# EAGLE design alarm clock_003 (EAGLE 5.11)
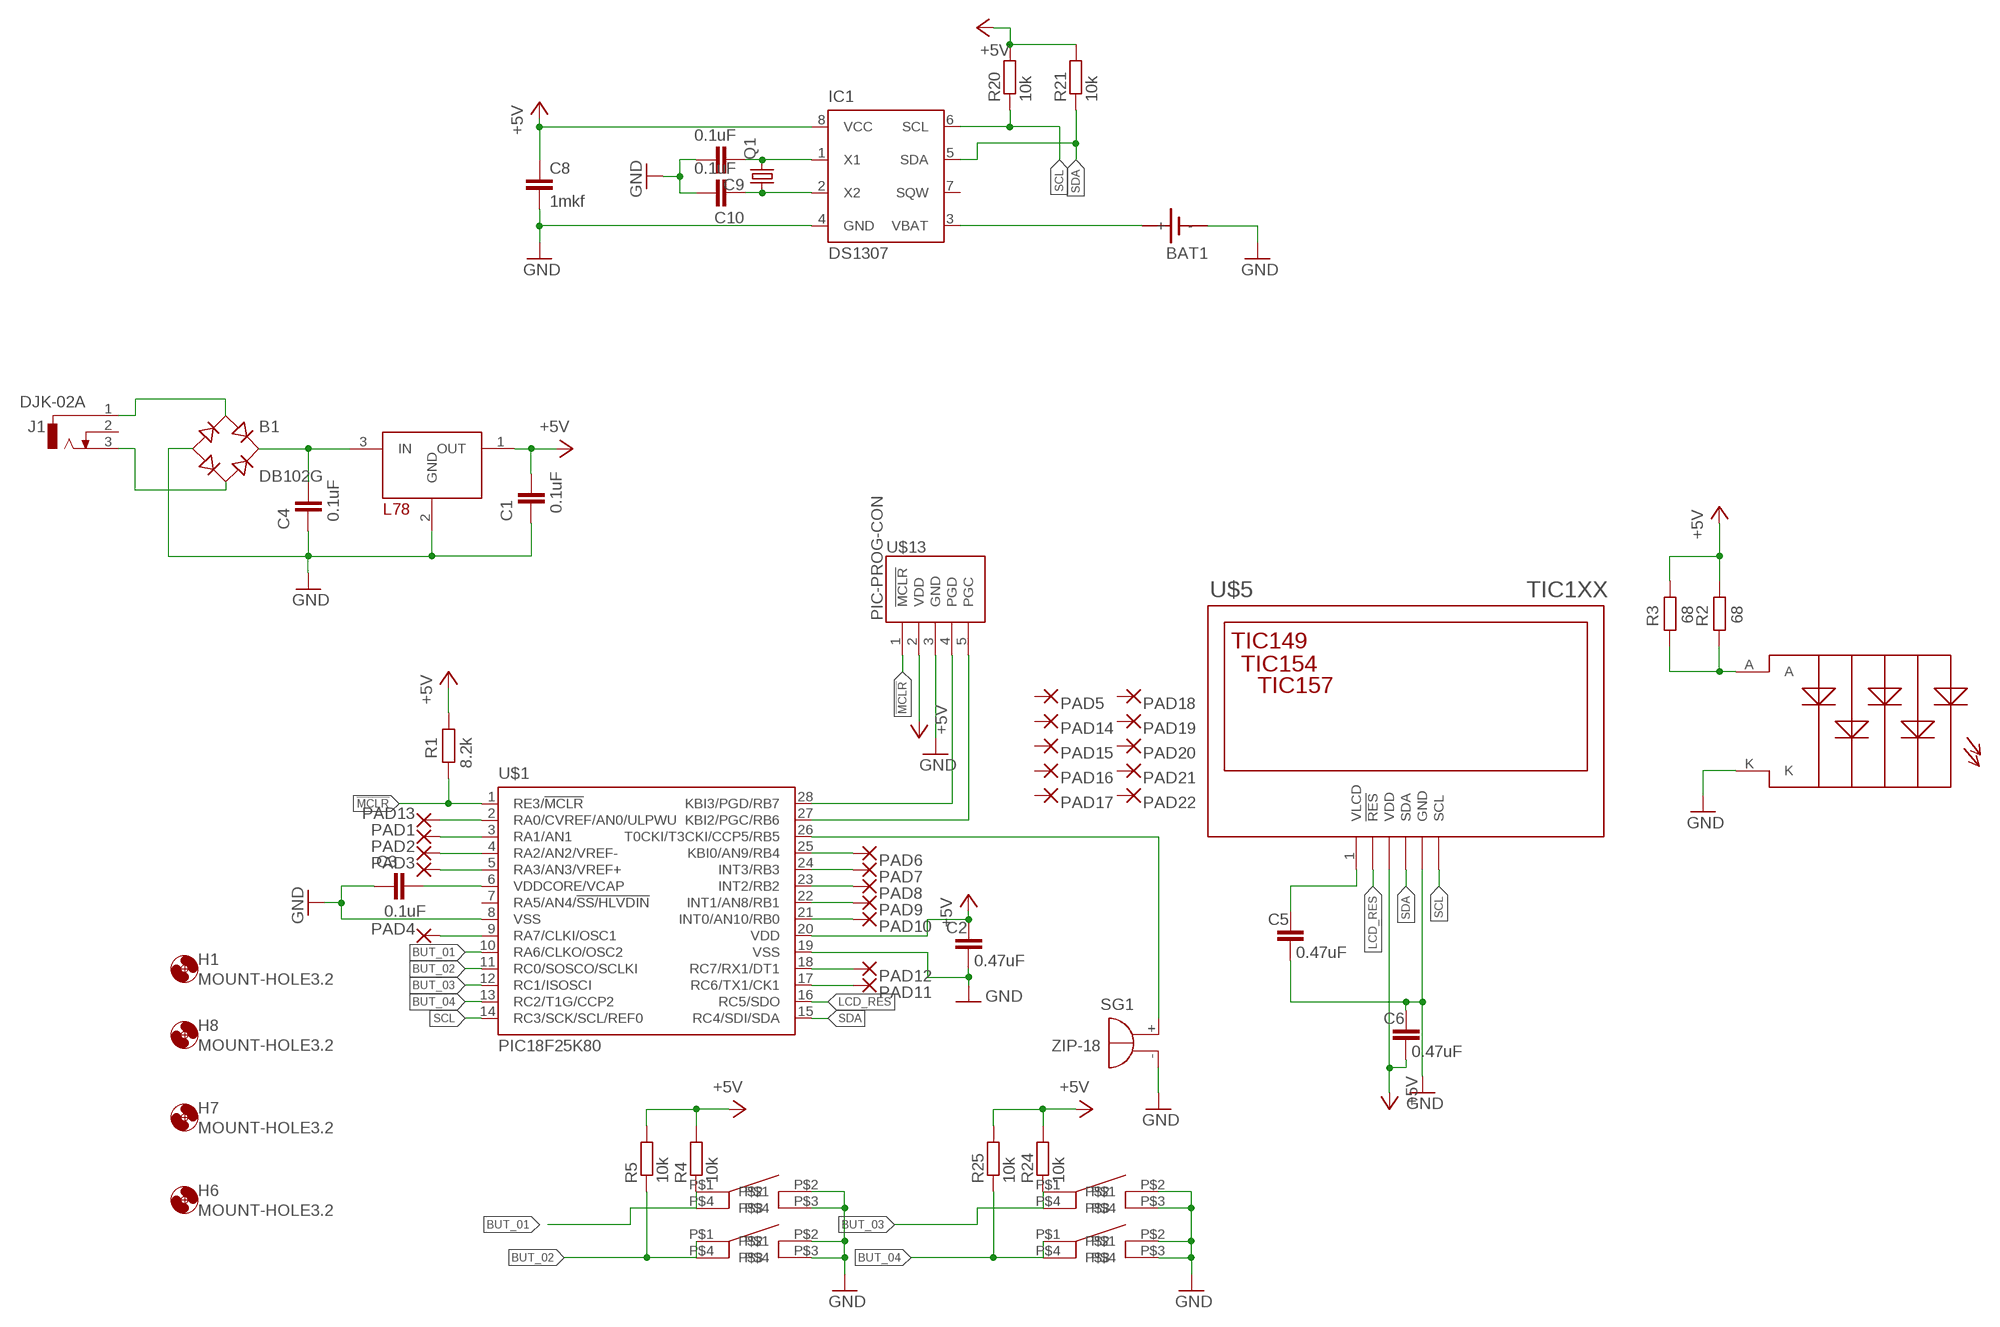
[diagram p0: schematic, sheet 1]

## Parts
B1  DB102G  [DB]
BAT1  SN2032  [SN2032]
C1  0.1uF  C-1206  [C1206]
C2  0.47uF  C-1206  [C1206]
C3  0.1uF  C-1206  [C1206]
C4  0.1uF  C-1206  [C1206]
C5  0.47uF  C-1206  [C1206]
C6  0.47uF  C-1206  [C1206]
C8  1mkf  C-1206  [C1206]
C9  0.1uF  C-1206  [C1206]
C10  0.1uF  C-1206  [C1206]
H1  MOUNT-HOLE3.2  [3,2]
H6  MOUNT-HOLE3.2  [3,2]
H7  MOUNT-HOLE3.2  [3,2]
H8  MOUNT-HOLE3.2  [3,2]
IC1  DS1307  [DIL08]
J1  DJK-02A  DCJ0303  [DCJ0303]
PAD1  SMD2  [SMD1,27-2,54]
PAD2  SMD2  [SMD1,27-2,54]
PAD3  SMD2  [SMD1,27-2,54]
PAD4  SMD2  [SMD1,27-2,54]
PAD5  SMD2  [SMD1,27-2,54]
PAD6  SMD2  [SMD1,27-2,54]
PAD7  SMD2  [SMD1,27-2,54]
PAD8  SMD2  [SMD1,27-2,54]
PAD9  SMD2  [SMD1,27-2,54]
PAD10  SMD2  [SMD1,27-2,54]
PAD11  SMD2  [SMD1,27-2,54]
PAD12  SMD2  [SMD1,27-2,54]
PAD13  SMD2  [SMD1,27-2,54]
PAD14  SMD2  [SMD1,27-2,54]
PAD15  SMD2  [SMD1,27-2,54]
PAD16  SMD2  [SMD1,27-2,54]
PAD17  SMD2  [SMD1,27-2,54]
PAD18  SMD2  [SMD1,27-2,54]
PAD19  SMD2  [SMD1,27-2,54]
PAD20  SMD2  [SMD1,27-2,54]
PAD21  SMD2  [SMD1,27-2,54]
PAD22  SMD2  [SMD1,27-2,54]
Q1  CRYSTALTC38H  [TC38H]
R1  8.2k  R-R1206  [R1206]
R2  68  R-R1206  [R1206]
R3  68  R-R1206  [R1206]
R4  10k  R-R1206  [R1206]
R5  10k  R-R1206  [R1206]
R20  10k  R-R1206  [R1206]
R21  10k  R-R1206  [R1206]
R24  10k  R-R1206  [R1206]
R25  10k  R-R1206  [R1206]
SG1  ZIP-18  EB2209A  [EB2209A]
U$1  PIC18F25K80  [SOIC-28]
U$2  L78  [TO92]
U$3  TIKBUTTON01  [TIKBUTTON01]
U$4  TIKBUTTON01  [TIKBUTTON01]
U$5  TIC1XX  [TIC1XX]
U$6  TB1025S  [TB1025S_38S_39S_40S]
U$7  TIKBUTTON01  [TIKBUTTON01]
U$8  TIKBUTTON01  [TIKBUTTON01]
U$13  PIC-PROG-CON  [PIC-PROG-CON]

## Nets
!MCLR [net8]: R1.2 U$1.1(RE3/!MCLR) U$13.1(!MCLR)
+5V [net8]: C1.2 C2.2 C6.1 C8.1 IC1.8(VCC) R1.1 R2.1 R3.1 R4.2 R5.2 R20.2 R21.2 R24.2 R25.2 U$1.20(VDD) U$2.1(OUT) U$5.3(VDD) U$13.2(VDD)
BUT_01: R4.1 U$1.10(RA6/CLKO/OSC2) U$7.P$1 U$7.P$4
BUT_02: R5.1 U$1.11(RC0/SOSCO/SCLKI) U$8.P$1 U$8.P$4
BUT_03: R24.1 U$1.12(RC1/ISOSCI) U$3.P$1 U$3.P$4
BUT_04: R25.1 U$1.13(RC2/T1G/CCP2) U$4.P$1 U$4.P$4
GND [net8]: B1.- BAT1.P$2(-) C1.1 C2.1 C3.1 C4.1 C5.1 C6.2 C8.2 C9.2 C10.2 IC1.4(GND) SG1.- U$1.8(VSS) U$1.19(VSS) U$2.2(GND) U$3.P$2 U$3.P$3 U$4.P$2 U$4.P$3 U$5.5(GND) U$6.K U$7.P$2 U$7.P$3 U$8.P$2 U$8.P$3 U$13.3(GND)
LCD_RES: U$1.16(RC5/SDO) U$5.2(!RES)
N$1: U$1.28(KBI3/PGD/RB7) U$13.4(PGD)
N$2: U$1.27(KBI2/PGC/RB6) U$13.5(PGC)
N$3: B1.AC1 J1.1
N$4: C3.2 U$1.6(VDDCORE/VCAP)
N$5: B1.AC2 J1.3
N$6: R2.2 R3.2 U$6.A
N$7: B1.+ C4.2 U$2.3(IN)
N$8: PAD13.1(P) U$1.2(RA0/CVREF/AN0/ULPWU)
N$9: C5.2 U$5.1(VLCD)
N$10: PAD1.1(P) U$1.3(RA1/AN1)
N$11: PAD2.1(P) U$1.4(RA2/AN2/VREF-)
N$12: PAD3.1(P) U$1.5(RA3/AN3/VREF+)
N$13: PAD4.1(P) U$1.9(RA7/CLKI/OSC1)
N$14: SG1.+ U$1.26(T0CKI/T3CKI/CCP5/RB5)
N$15: PAD6.1(P) U$1.25(KBI0/AN9/RB4)
N$16: PAD7.1(P) U$1.24(INT3/RB3)
N$17: PAD8.1(P) U$1.23(INT2/RB2)
N$18: PAD9.1(P) U$1.22(INT1/AN8/RB1)
N$19: PAD10.1(P) U$1.21(INT0/AN10/RB0)
N$20: PAD12.1(P) U$1.18(RC7/RX1/DT1)
N$21: C9.1 IC1.1(X1) Q1.2
N$22: C10.1 IC1.2(X2) Q1.1
N$23: BAT1.P$1(+) IC1.3(VBAT)
N$24: PAD11.1(P) U$1.17(RC6/TX1/CK1)
SCL: IC1.6(SCL) R20.1 U$1.14(RC3/SCK/SCL/REF0) U$5.6(SCL)
SDA: IC1.5(SDA) R21.1 U$1.15(RC4/SDI/SDA) U$5.4(SDA)
Unconnected: IC1.7(SQW) J1.2 PAD5.1(P) PAD14.1(P) PAD15.1(P) PAD16.1(P) PAD17.1(P) PAD18.1(P) PAD19.1(P) PAD20.1(P) PAD21.1(P) PAD22.1(P) U$1.7(RA5/AN4/!SS/HLVDIN)

## Library data of the parts
B1 = rectifier:DB?10*G: Single Phase 1.0 AMP Glass Passivated Bridge Rectifier Taiwan Semiconductor Co.,Ltd. - TSC Source: http://www.taiwansemi.com/TSCbig5/ezcatfiles/cust/img/img/db101g.pdf
BAT1 = sn2032:SN2032: LI BATTERY dip07
C1-C6 C8-C10 = quantum-sensor:C: Capacitor
H1 H6-H8 = holes:MOUNT-HOLE: MOUNTING HOLE with drill center marker
IC1 = ds1307_pcf8583:DS1307: I2C-Bus CLOCK/CALENDAR
J1 = con-jack:DCJ0303: DC POWER JACK Source: DCJ0303.pdf
PAD1-PAD22 = wirepad:SMD2: SMD PAD
Q1 = crystal:CRYSTAL: CRYSTAL
R1-R5 R20 R21 R24 R25 = quantum-sensor:R: Resistor
SG1 = buzzer:EB2209A: BUZZER Source: Buerklin
U$1 = microchip_PIC18f25K80:PIC18F25K80: pic18 pic18f25k80
U$2 = TO92:L78: L78 TO92
U$3 U$4 U$7 U$8 = buttons:TIKBUTTON01: button tik
U$5 = TIC:TIC1XX: TIC TIC1xx TIC149 TIC154 TIC157
U$6 = TIC:TB1025S: podsvetka TB1025S TB1038S TB1039S TB1040S
U$13 = pic_prog_con:PIC-PROG-CON: pic prog con pic_prog pic_prog_con

## Net classes
1 power: width 7.976 mm
2 net12: width 0.305 mm
6 net8: width 0.203 mm

## Board
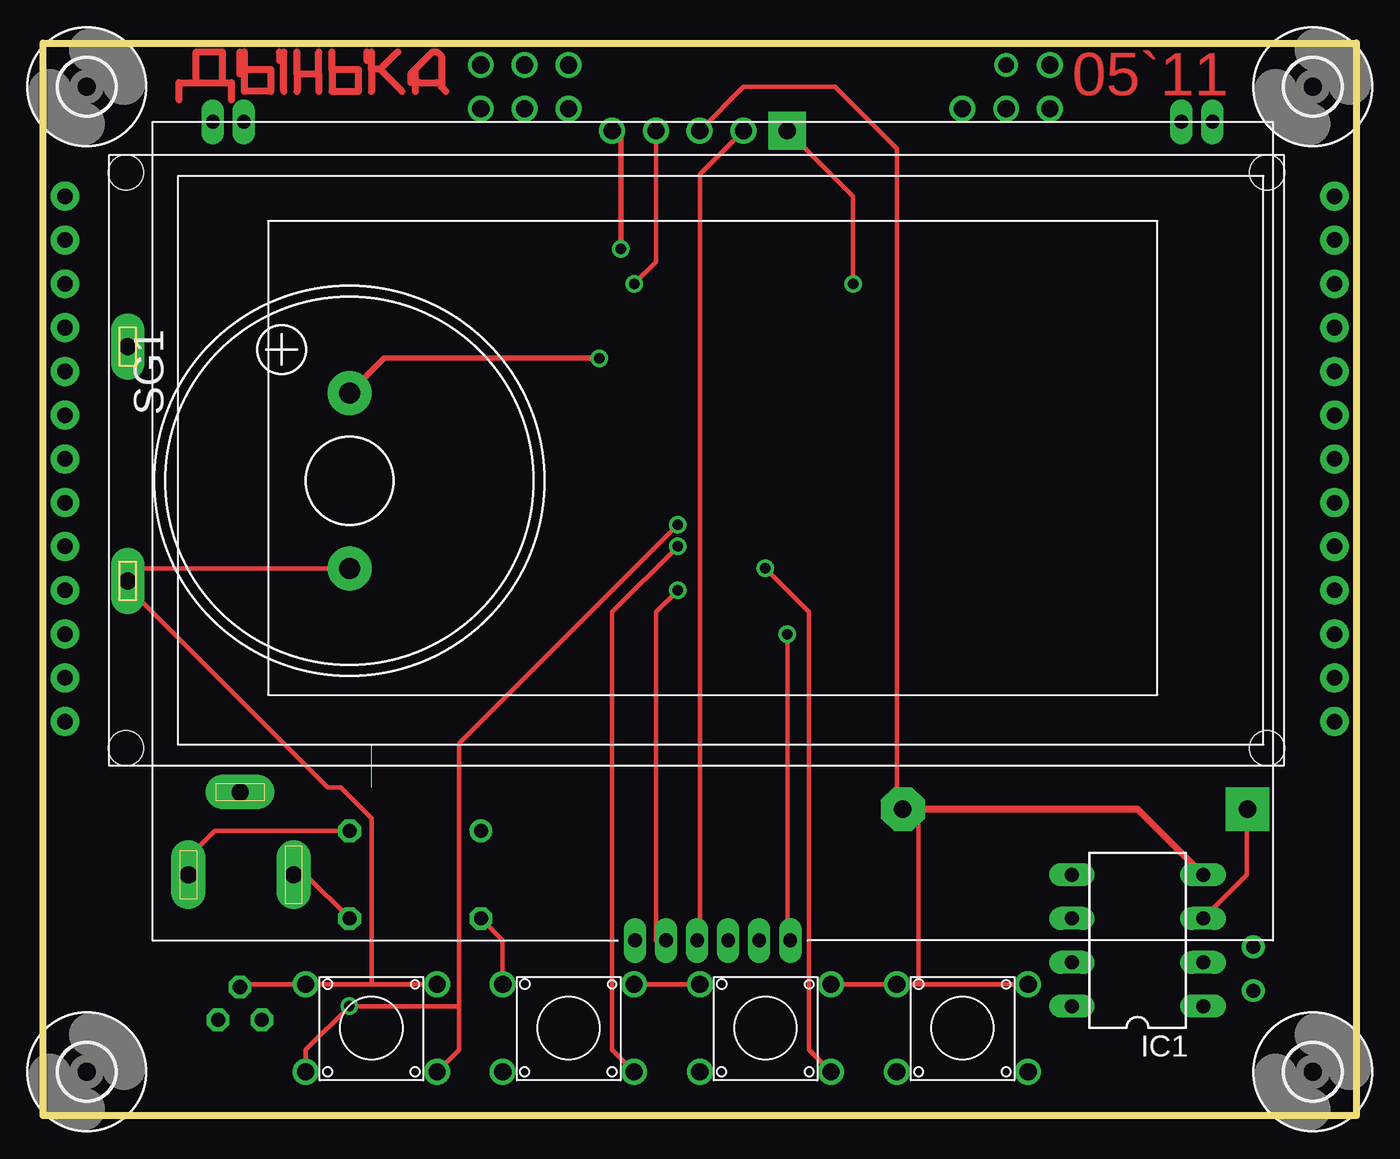
[diagram p1: board, top side]
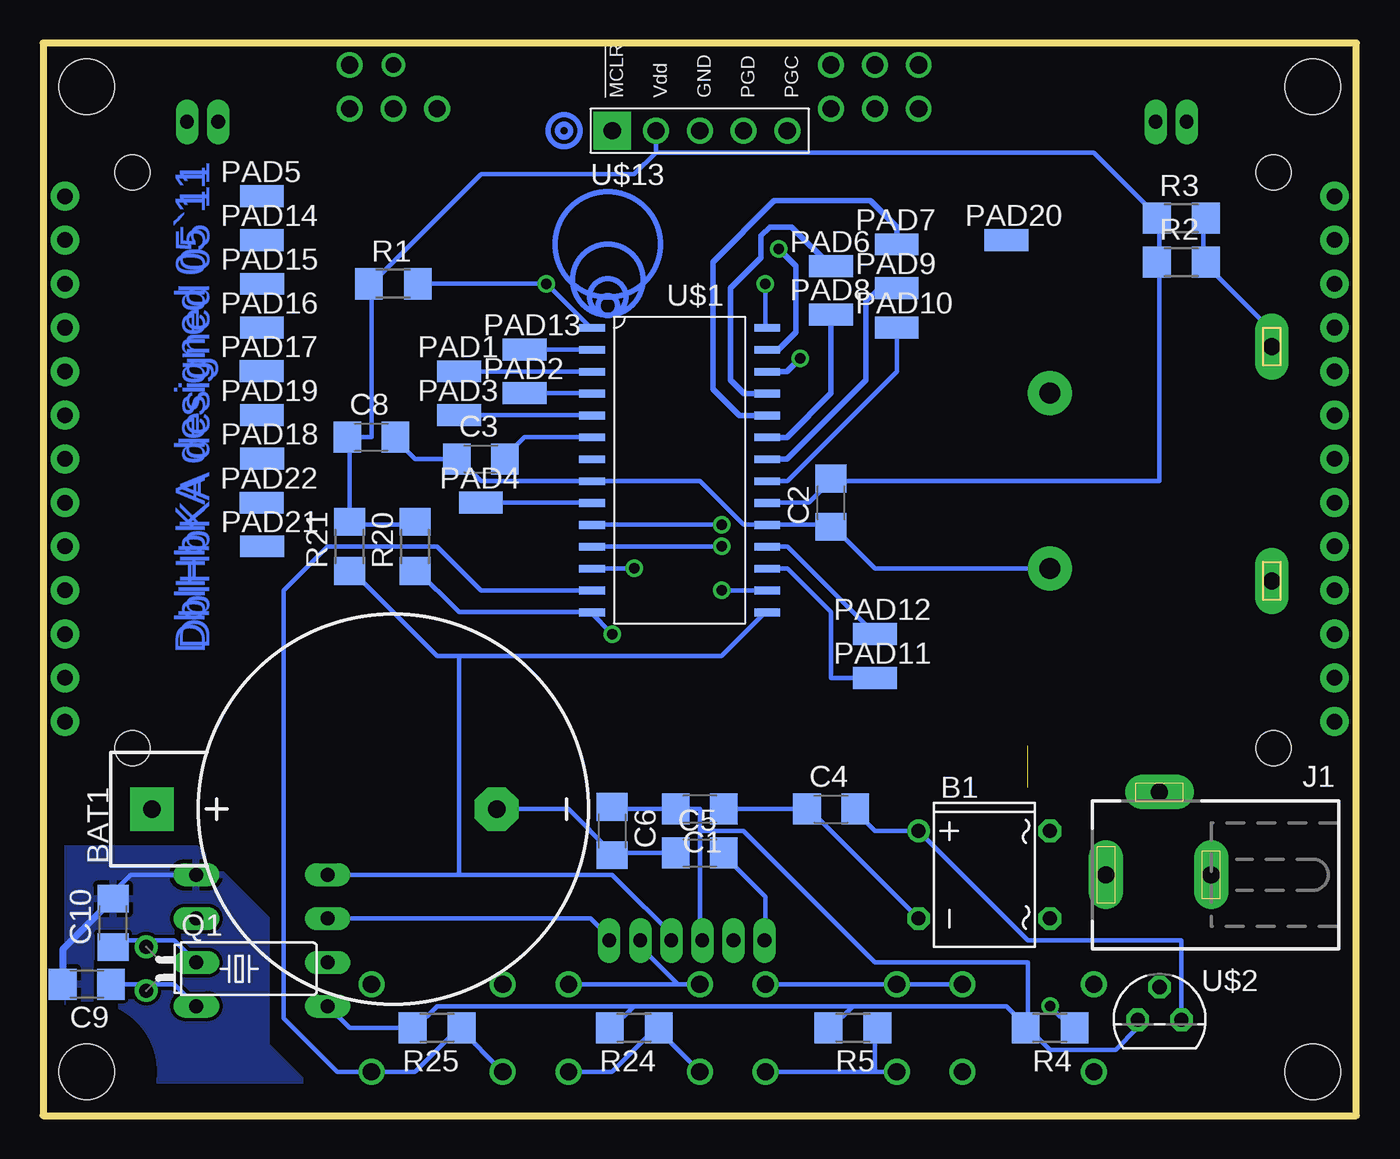
[diagram p2: board, bottom side, seen from below]

Size 76.2 x 62.23 mm. Coordinates in mm from the lower left corner, seen from the top.
Outline: 0,0 0,62.23 76.2,62.23 76.2,0 0,0
Copper layers (1*16): Top 0.035mm / dielectric 1.5mm / Bottom 0.035mm
Design rules "default *": minimum track width 10mil, minimum drill 24mil, track to track 8mil, track to pad 8mil, pad to pad 8mil, via to via 8mil, smd to smd 8mil, copper to edge 40mil, drill to drill 8mil, minimum pad ring 10mil, minimum via ring 8mil, stop-mask expansion 4mil, vias tented up to drill 24mil, thermal gap 10mil

### Footprints (pad centres in the part's own frame; a part is rotated, then mirrored left to right if it is on the bottom)
DB = drill 0.813 round: + -2.54,-3.81 | drill 0.813 octagon: - 2.54,-3.81; AC1 2.54,3.81; AC2 -2.54,3.81
SN2032 = drill 1 pad 2.54 square: P$1 0,14 | drill 1 pad 2.54 octagon: P$2 0,-6
C1206 = smd 1.6 x 1.8: 1 -1.4,0; 2 1.4,0
3,2 = hole 3.2: 0,0
DIL08 = drill 0.813 long: 1 -3.81,-3.81; 2 -1.27,-3.81; 3 1.27,-3.81; 4 3.81,-3.81; 5 3.81,3.81; 6 1.27,3.81; 7 -1.27,3.81; 8 -3.81,3.81
DCJ0303 = drill 1 pad 2 long: 1 0,3.1; 2 4.8,0; 3 0,-3
SMD1,27-2,54 = smd 1.27 x 2.54: 1 0,0
TC38H = drill 0.813 round: 1 -1.27,0; 2 1.27,0
R1206 = smd 1.6 x 1.803: 1 -1.422,0; 2 1.422,0
EB2209A = drill 1.2 pad 2.54 round: + 5.093,0; - -5.093,0
SOIC-28 = smd 1.5 x 0.45: 1 -5.23,7.98; 2 -5.23,6.71; 3 -5.23,5.44; 4 -5.23,4.17; 5 -5.23,2.9; 6 -5.23,1.63; 7 -5.23,0.36; 8 -5.23,-0.91; 9 -5.23,-2.18; 10 -5.23,-3.45; 11 -5.23,-4.72; 12 -5.23,-5.99; 13 -5.23,-7.26; 14 -5.23,-8.53; 15 4.93,-8.53; 16 4.93,-7.26; 17 4.93,-5.99; 18 4.93,-4.72; 19 4.93,-3.45; 20 4.93,-2.18; 21 4.93,-0.91; 22 4.93,0.36; 23 4.93,1.63; 24 4.93,2.9; 25 4.93,4.17; 26 4.93,5.44; 27 4.93,6.71; 28 4.93,7.98
TO92 = drill 0.813 octagon: 1 -1.26,-0.8; 2 0.01,1.105; 3 1.28,-0.8
TIKBUTTON01 = drill 1 round: P$1 0,0; P$2 5.08,0; P$3 5.08,7.62; P$4 0,7.62
TIC1XX = drill 0.8 long: 1 28,0; 2 29.8,0; 3 31.6,0; 4 33.4,0; 5 35.2,0; 6 37,0; P$7 3.5,47.5; P$8 61.5,47.5; P$9 5.3,47.5; P$10 59.7,47.5
TB1025S_38S_39S_40S = drill 1 pad 1.93 long: A 1.1,24.3; K 1.1,10.7 | hole 2: 1,1; 67.2,1; 1,34.4; 67.2,34.4
PIC-PROG-CON = drill 1 pad 2.184 square: 1 -3.81,0 | drill 1 round: 2 -1.27,0; 3 1.27,0; 4 3.81,0; 5 6.35,0

### Placement (x,y rotation side)
B1  21.59,13.97 270 bottom
BAT1  55.88,17.78 90 bottom
C1  38.1,17.78 180 bottom
C2  30.48,35.56 90 bottom
C3  50.8,38.1 0 bottom
C4  30.48,17.78 0 bottom
C5  38.1,15.24 0 bottom
C6  43.18,16.51 270 bottom
C8  57.15,39.37 0 bottom
C9  73.66,7.62 180 bottom
C10  72.14,11.18 90 bottom
H1  73.66,59.69 0 top
H6  73.66,2.54 0 top
H7  2.54,2.54 0 top
H8  2.54,59.69 0 top
IC1  63.5,10.16 90 top
J1  11.43,13.97 90 bottom
PAD1  52.07,43.18 270 bottom
PAD2  48.26,41.91 270 bottom
PAD3  52.07,40.64 270 bottom
PAD4  50.8,35.56 270 bottom
PAD5  63.5,53.34 270 bottom
PAD6  30.48,49.28 270 bottom
PAD7  26.67,50.55 270 bottom
PAD8  30.48,46.48 270 bottom
PAD9  26.67,48.01 270 bottom
PAD10  26.67,45.72 270 bottom
PAD11  27.94,25.4 270 bottom
PAD12  27.94,27.94 270 bottom
PAD13  48.26,44.45 270 bottom
PAD14  63.51,50.8 270 bottom
PAD15  63.49,48.26 270 bottom
PAD16  63.5,45.71 270 bottom
PAD17  63.51,43.19 270 bottom
PAD18  63.5,38.12 270 bottom
PAD19  63.5,40.63 270 bottom
PAD20  20.32,50.8 270 bottom
PAD21  63.48,33.03 270 bottom
PAD22  63.52,35.56 270 bottom
Q1  70.22,8.52 270 bottom
R1  55.88,48.26 0 bottom
R2  10.16,49.53 0 bottom
R3  10.16,52.07 0 bottom
R4  17.78,5.08 180 bottom
R5  29.21,5.08 180 bottom
R20  54.61,33.02 90 bottom
R21  58.42,33.02 90 bottom
R24  41.91,5.08 180 bottom
R25  53.34,5.08 180 bottom
SG1  17.78,36.83 90 top
U$1  39.12,37.72 0 bottom
U$2  11.43,6.35 0 bottom
U$3  45.72,2.54 90 top
U$4  57.15,2.54 90 top
U$5  6.35,10.16 0 top
U$6  3.81,20.32 0 top
U$7  22.86,2.54 90 top
U$8  34.29,2.54 90 top
U$13  39.37,57.15 0 bottom

### Tracks (layer width: path | path; a pad name or v marks a point on that pad's centre or on a via)
!MCLR  (via drill 0.61)
  Top 0.254: U$13.1 46.99,53.34 v46.99,48.26
  Bottom 0.254: U$1.1 44.45,45.72 v46.99,48.26 R1.2 54.61,48.26
+5V
  Top 0.254: U$13.2 38.1,54.61 38.1,10.16 U$5.3
  Bottom 0.254: 19.05,5.08 17.78,3.81 13.97,3.81 12.7,5.08 U$2.1 | 29.21,6.35 30.48,5.08 R5.2 | 29.21,6.35 20.32,6.35 19.05,5.08 | 41.91,6.35 43.18,5.08 R24.2 | 29.21,6.35 41.91,6.35 | 41.91,6.35 53.34,6.35 54.61,5.08 R25.2 58.42,5.08 IC1.8 | C6.1 43.18,17.78 C1.2 38.1,17.78 38.1,16.51 | 38.1,16.51 38.1,10.16 U$5.3 | R20.2 54.61,34.29 58.42,34.29 R21.2 58.42,39.37 | 19.05,5.08 19.05,8.89 27.94,8.89 35.56,16.51 38.1,16.51 | 19.05,5.08 R4.2 | 11.43,52.07 11.43,49.53 | 30.48,36.83 31.75,35.56 34.29,35.56 U$1.20 | 11.43,49.53 11.43,36.83 30.48,36.83 | 11.43,49.53 R2.1 | 30.48,36.83 C2.2 | 57.15,48.26 57.15,39.37 58.42,39.37 | 58.42,39.37 C8.1 | 57.15,48.26 50.8,54.61 41.91,54.61 40.64,55.88 | U$13.2 40.64,55.88 | 57.15,48.26 R1.1 | 11.43,52.07 15.24,55.88 40.64,55.88 | 11.43,52.07 R3.1
BUT_01  (via drill 0.61)
  Top 0.254: U$7.P$4 15.24,3.81 v17.78,6.35 24.13,6.35 | 24.13,6.35 24.13,3.81 U$7.P$1 | 24.13,6.35 24.13,21.59 v36.83,34.29
  Bottom 0.254: v17.78,6.35 16.51,5.08 R4.1 | v36.83,34.29 44.45,34.29 U$1.10
BUT_02  (via drill 0.61)
  Top 0.254: U$8.P$1 33.02,3.81 33.02,29.21 v36.83,33.02
  Bottom 0.254: 27.94,2.54 27.94,5.08 R5.1 | U$8.P$4 27.94,2.54 | 27.94,2.54 U$8.P$1 | v36.83,33.02 44.45,33.02 U$1.11
BUT_03  (via drill 0.61)
  Top 0.254: v41.91,31.75 44.45,29.21 44.45,3.81 U$3.P$1
  Bottom 0.254: U$3.P$4 40.64,5.08 | v41.91,31.75 44.45,31.75 U$1.12 | 40.64,5.08 43.18,2.54 U$3.P$1 | 40.64,5.08 R24.1
BUT_04
  Bottom 0.254: U$4.P$4 52.07,5.08 | 52.07,5.08 54.61,2.54 U$4.P$1 59.13,2.54 62.23,5.64 62.23,30.48 59.69,33.02 53.34,33.02 50.8,30.48 44.45,30.48 U$1.13 | 52.07,5.08 R25.1
GND  (1 unrouted)
  Top 0.254: U$13.3 40.64,59.69 45.94,59.69 49.53,56.1 49.53,17.78 BAT1.P$2 50.8,17.78 50.8,7.62 | U$2.2 11.43,7.62 U$7.P$3 19.05,7.62 | B1.- 26.67,10.16 U$8.P$3 | 19.05,7.62 U$7.P$2 | U$3.P$2 U$4.P$3 50.8,7.62 | U$8.P$2 U$3.P$3 | 50.8,7.62 U$4.P$2 | SG1.- 5.08,31.75 U$6.K 5.08,30.48 16.51,19.05 17.25,19.05 19.05,17.25 19.05,7.62
  Top 0.406: 49.53,17.78 63.5,17.78 IC1.4
  Bottom 0.254: C8.2 55.88,39.37 54.61,38.1 C3.1 52.07,38.1 50.8,36.83 44.45,36.83 | U$6.K 5.08,31.75 | 43.18,15.24 C5.1 39.37,15.24 | 43.18,15.24 45.72,17.78 BAT1.P$2 | 43.18,15.24 C6.2 | 36.83,17.78 C1.1 C4.1 31.75,17.78 B1.- | U$7.P$2 U$8.P$3 U$8.P$2 | 39.37,7.62 41.91,10.16 U$5.5 | U$3.P$3 39.37,7.62 | 39.37,7.62 U$3.P$2 | IC1.4 71.12,13.97 72.39,12.7 C10.2 | 30.48,34.29 34.29,34.29 | 30.48,34.29 27.94,31.75 SG1.- | 30.48,34.29 C2.1 | 44.45,36.83 38.1,36.83 35.56,34.29 34.29,34.29 | 44.45,36.83 U$1.8 | 34.29,34.29 U$1.19
  Bottom 0.406: C9.2 75.06,9.65 C10.2
  pour Bottom: 61.21,2.03 72.14,2.03 75.69,4.06 75.69,15.49 67.31,15.49 63.25,11.43 63.25,4.06
LCD_RES  (via drill 0.61)
  Top 0.254: v36.83,30.48 35.56,29.21 35.56,10.16 U$5.2
  Bottom 0.254: v36.83,30.48 34.29,30.48 U$1.16
N$1  (via drill 0.61)
  Top 0.254: v34.29,48.26 35.56,49.53 U$13.4
  Bottom 0.254: v34.29,48.26 34.29,45.72 U$1.28
N$2  (via drill 0.61)
  Top 0.305: v33.53,50.29 33.53,56.64 U$13.5
  Bottom 0.305: U$1.27 33.55,44.43 32.51,45.47 32.51,49.28 v33.53,50.29
N$3
  Top 0.254: B1.AC1 15.24,13.97 J1.1
N$4
  Bottom 0.254: U$1.6 44.45,39.37 48.26,39.37 49.53,38.1 C3.2
N$5
  Top 0.254: B1.AC2 9.97,16.51 8.89,15.43 8.89,13.97 J1.3
N$6
  Bottom 0.254: 5.08,44.45 U$6.A 5.08,45.72 8.89,49.53 | 8.89,49.53 8.89,52.07 R3.2 | 8.89,49.53 R2.2
N$7
  Bottom 0.254: C4.2 29.21,17.78 27.94,16.51 B1.+ 19.05,10.16 10.16,10.16 10.16,5.08 U$2.3
N$8
  Bottom 0.254: PAD13.1 44.45,44.45 U$1.2
N$9
  Bottom 0.254: C5.2 36.83,15.24 34.29,12.7 34.29,10.16 U$5.1
N$10
  Bottom 0.254: PAD1.1 44.45,43.18 U$1.3
N$11
  Bottom 0.254: PAD2.1 44.45,41.91 U$1.4
N$12
  Bottom 0.254: PAD3.1 44.45,40.64 U$1.5
N$13
  Bottom 0.254: PAD4.1 44.45,35.56 U$1.9
N$14  (via drill 0.61)
  Top 0.305: v32.26,43.94 19.8,43.94 SG1.+
  Bottom 0.305: U$1.26 33.04,43.16 v32.26,43.94
N$15
  Bottom 0.305: U$1.25 35.54,41.89 36.32,42.67 36.32,48.01 34.54,49.78 34.54,51.05 34.04,51.56 32.77,51.56 PAD6.1
N$16
  Bottom 0.305: U$1.24 35.79,40.62 37.34,42.16 37.34,49.53 33.78,53.09 28.19,53.09 26.67,51.56 PAD7.1
N$17
  Bottom 0.305: U$1.23 33.04,39.35 30.48,41.91 PAD8.1
N$18
  Bottom 0.305: U$1.22 33.04,38.08 28.45,42.67 28.45,47.24 27.69,48.01 PAD9.1
N$19
  Bottom 0.254: PAD10.1 26.67,43.18 33.02,36.83 34.29,36.83 U$1.21
N$20
  Bottom 0.254: PAD12.1 33.02,33.02 34.29,33.02 U$1.18
N$21
  Bottom 0.254: 69.85,7.62 C9.1 72.39,7.62 | IC1.1 68.58,7.62 69.85,7.62 | 69.85,7.62 Q1.2
N$22
  Bottom 0.254: 69.85,10.16 72.39,10.16 C10.1 | IC1.2 68.58,10.16 69.85,10.16 | 69.85,10.16 Q1.1
N$23
  Top 0.254: IC1.3 69.85,13.97 69.85,17.78 BAT1.P$1
N$24
  Bottom 0.254: PAD11.1 30.48,25.4 30.48,29.21 33.02,31.75 34.29,31.75 U$1.17
N$25
  Top 0.406: 10.41,59.94 10.41,61.72 8.89,61.72 8.89,59.94 | 8.89,59.94 10.41,59.94 | 8.89,59.94 7.87,59.94 7.87,58.93 | 10.41,59.94 10.92,59.94 10.92,58.93
N$26
  Top 0.406: 11.68,61.72 11.68,59.44 13.21,59.44 13.21,60.71 11.94,60.71
N$27
  Top 0.406: 11.43,60.45 11.43,61.72
N$28
  Top 0.406: 13.72,61.72 13.72,61.21
N$29
  Top 0.406: 13.97,59.44 13.97,61.72
N$30
  Top 0.406: 14.73,60.45 14.73,61.72 | 14.73,60.45 14.73,59.44 | 14.73,60.45 16,60.45 | 16,60.45 16,61.72 | 16,60.45 16,59.44
N$31
  Top 0.406: 16.76,60.71 16.76,61.72 | 16.76,60.71 16.76,59.44 18.29,59.44 18.29,60.71 16.76,60.71
N$32
  Top 0.406: 18.8,61.72 18.8,61.21 19.05,61.21 | 19.05,61.21 19.05,61.72 | 19.05,60.71 19.05,61.21 | 19.05,60.71 19.05,59.44 | 19.56,60.71 19.05,60.71 | 19.56,60.71 20.57,61.72 | 19.56,60.71 20.83,59.44
N$33
  Top 0.406: 21.59,60.71 21.59,59.44 | 21.59,60.71 22.61,61.72 22.86,61.72 23.11,61.47 23.11,59.69 23.37,59.44 | 21.59,60.71 21.34,60.45 21.34,59.94
N$34
  Top 0.406: 21.84,59.94 22.86,59.94
N$35  (via drill 1)
  other vias: 58.42,58.42
N$36  (via drill 0.9)
  other vias: 55.88,60.96
N$37  (via drill 0.9 pad 1.68)
  other vias: 74.93,53.34
N$38  (via drill 0.9 pad 1.68)
  other vias: 74.93,50.8
N$39  (via drill 0.9 pad 1.68)
  other vias: 74.93,48.26
N$40  (via drill 0.9 pad 1.68)
  other vias: 74.93,45.72
N$41  (via drill 0.9 pad 1.68)
  other vias: 74.93,43.18
N$42  (via drill 0.9 pad 1.68)
  other vias: 74.93,40.64
N$43  (via drill 0.9 pad 1.68)
  other vias: 74.93,38.1
N$44  (via drill 0.9 pad 1.68)
  other vias: 74.93,35.56
N$45  (via drill 0.9 pad 1.68)
  other vias: 74.93,33.02
N$46  (via drill 0.9 pad 1.68)
  other vias: 74.93,30.48
N$47  (via drill 0.9 pad 1.68)
  other vias: 74.93,27.94
N$48  (via drill 0.9 pad 1.68)
  other vias: 74.93,25.4
N$49  (via drill 1)
  other vias: 30.48,60.96
N$50  (via drill 0.9 pad 1.68)
  other vias: 74.93,22.86
N$51  (via drill 0.9 pad 1.68)
  other vias: 1.27,53.34
N$52  (via drill 0.9 pad 1.68)
  other vias: 1.27,50.8
N$53  (via drill 0.9 pad 1.68)
  other vias: 1.27,48.26
N$54  (via drill 0.9 pad 1.68)
  other vias: 1.27,45.72
N$55  (via drill 0.9 pad 1.68)
  other vias: 1.27,43.18
N$56  (via drill 0.9 pad 1.68)
  other vias: 1.27,40.64
N$57  (via drill 0.9 pad 1.68)
  other vias: 1.27,38.1
N$58  (via drill 0.9 pad 1.68)
  other vias: 1.27,35.56
N$59  (via drill 0.9 pad 1.68)
  other vias: 1.27,33.02
N$60  (via drill 0.9 pad 1.68)
  other vias: 1.27,30.48
N$61  (via drill 0.9 pad 1.68)
  other vias: 1.27,27.94
N$62  (via drill 0.9 pad 1.68)
  other vias: 1.27,25.4
N$63  (via drill 0.9 pad 1.68)
  other vias: 1.27,22.86
N$132  (via drill 1)
  other vias: 55.88,58.42
N$133  (via drill 1)
  other vias: 53.34,58.42
N$136  (via drill 1)
  other vias: 58.42,60.96
N$147  (via drill 1)
  other vias: 30.48,58.42
N$148  (via drill 1)
  other vias: 27.94,58.42
N$149  (via drill 1)
  other vias: 25.4,58.42
N$150  (via drill 1)
  other vias: 25.4,60.96
N$151  (via drill 1)
  other vias: 27.94,60.96
SCL  (via drill 0.61)
  Top 0.254: v43.18,27.94 43.18,10.16 U$5.6
  Bottom 0.254: 44.45,29.21 52.07,29.21 54.61,31.75 R20.1 | U$5.6 43.18,10.16 44.45,11.43 IC1.6 | v43.18,27.94 44.45,29.21 | 44.45,29.21 U$1.14
SDA
  Bottom 0.254: 52.07,13.97 43.18,13.97 39.37,10.16 U$5.4 | 52.07,26.67 53.34,26.67 58.42,31.75 R21.1 | 52.07,13.97 52.07,26.67 | 52.07,13.97 IC1.5 | 52.07,26.67 36.83,26.67 34.29,29.21 U$1.15
(copper drawn outside any net)
  shapes: Bottom circle x6

### Text on the board
Top: 05`11
Bottom: DblHbKA designed 05`11 | DblHbKA designed 05`11